# Altium schematic sheet Auxboardone.SchDoc
size Tabloid; SheetNumber: 1; SheetTotal: 1
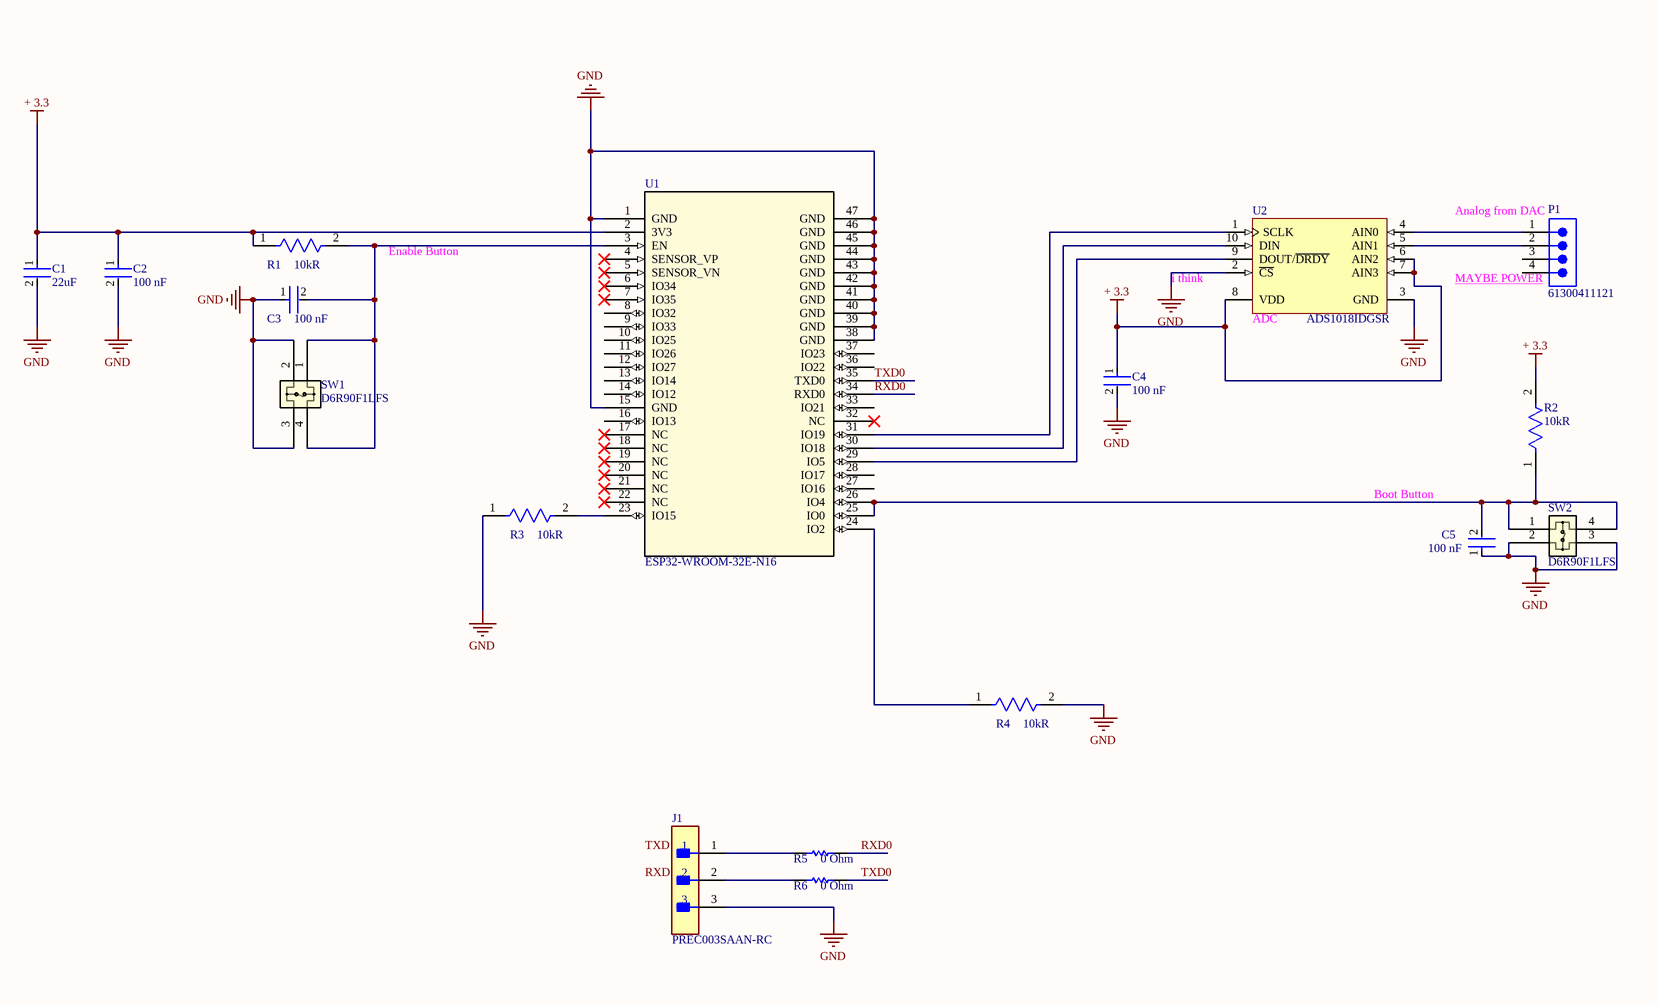
[diagram p0: Auxboardone.SchDoc, right]

## Parts
C1  Capacitance: 22uF  [FP-CL21-IPC_A]  (hidden comment: CL21A226MQQNNNE)
C2  Capacitance: 100 nF  [FP-CC0805-0_85-MFG]  (hidden comment: CC0805KRX7R9BB104)
C3  Capacitance: 100 nF  [FP-CC0805-0_85-MFG]  (hidden comment: CC0805KRX7R9BB104)
C4  Capacitance: 100 nF  [FP-CC0805-0_85-MFG]  (hidden comment: CC0805KRX7R9BB104)
C5  Capacitance: 100 nF  [FP-CC0805-0_85-MFG]  (hidden comment: CC0805KRX7R9BB104)
J1  PREC003SAAN-RC  [FP-PREC003SAAN-RC-MFG]
P1  61300411121  [61300411121]
R1  Resistance: 10kR  [FP-RR1220-IPC_A]  (hidden comment: RR1220P-103-D)
R2  Resistance: 10kR  [FP-RR1220-IPC_A]  (hidden comment: RR1220P-103-D)
R3  Resistance: 10kR  [FP-RR1220-IPC_A]  (hidden comment: RR1220P-103-D)
R4  Resistance: 10kR  [FP-RR1220-IPC_A]  (hidden comment: RR1220P-103-D)
R5  Resistance: 0 Ohm  [RESC2013X70X40NL20T20]  (hidden comment: ERJ-6GEY0R00V)
R6  Resistance: 0 Ohm  [RESC2013X70X40NL20T20]  (hidden comment: ERJ-6GEY0R00V)
SW1  D6R90F1LFS  [D6R_CNK]
SW2  D6R90F1LFS  [D6R_CNK]
U1  ESP32-WROOM-32E-N16  [ESP32-WROOM-32E_EXP]
U2  ADS1018IDGSR  [TI-DGS10_N]

## Nets
+ 3.3: C1.1 C2.1 C4.1 R1.1 R2.2 U1.2(3V3) U2.6(AIN2) U2.7(AIN3) U2.8(VDD)
GND: C1.2 C2.2 C3.1 C4.2 C5.1 J1.3 R3.1 R4.2 SW1.2 SW1.3 SW2.2 SW2.3 U1.1(GND) U1.15(GND) U1.38(GND) U1.39(GND) U1.40(GND) U1.41(GND) U1.42(GND) U1.43(GND) U1.44(GND) U1.45(GND) U1.46(GND) U1.47(GND) U2.2(~{CS}) U2.3(GND)
RXD0: R5.2 U1.34(RXD0)
TXD0: R6.2 U1.35(TXD0)
NetC3_2: C3.2 R1.2 SW1.1 SW1.4 U1.3(EN)
NetC5_2: C5.2 R2.1 SW2.1 SW2.4 U1.25(IO0) U1.26(IO4)
NetJ1_1: J1.1 R5.1
NetJ1_2: J1.2 R6.1
NetP1_1: P1.1 U2.4(AIN0)
NetP1_2: P1.2 U2.5(AIN1)
NetR3_2: R3.2 U1.23(IO15)
NetR4_1: R4.1 U1.24(IO2)
NetU1_29: U1.29(IO5) U2.9(DOUT/~{DRDY})
NetU1_30: U1.30(IO18) U2.10(DIN)
NetU1_31: U1.31(IO19) U2.1(SCLK)

Not connected (* = marked no-connect by the designer): P1 3 4; U1 4(SENSOR_VP)* 5(SENSOR_VN)* 6(IO34)* 7(IO35)* 8(IO32) 9(IO33) 10(IO25) 11(IO26) 12(IO27) 13(IO14) 14(IO12) 16(IO13) 17(NC)* 18(NC)* 19(NC)* 20(NC)* 21(NC)* 22(NC)* 27(IO16) 28(IO17) 32(NC)* 33(IO21) 36(IO22) 37(IO23)

## Notes on the sheet
- Enable Button
- (near P1) Analog from DAC
- (near U2) i think
- (near U2) ADC
- (near P1) MAYBE POWER
- Boot Button
- Labels drawn without touching a wire or pin: RXD, TXD

## Library data of the parts
C1 = CMP-13271-000185-1: CL21 Series 0805 22uF 6.3V ±20% Tolerance X5R Multilayer Ceramic Chip Capacitor; Height: 1.25mm; Length: 2mm; Mount: Surface Mount; Dielectric: X5R; Voltage Rating (DC): 6.3V; Case Code (Metric): 2012; Depth: 1.25mm; Max Operating Temperature: 85°C; Voltage Rating: 6.3V; Width: 0.049inch; Case/Package: 0805; Radiation Hardening: No; Thickness: 0.055inch; Packaging: Tape and Reel; Package Quantity: 2000; Lead Free: Lead Free; Contact Plating: Tin; Min Operating Temperature: -55°C; Case Code (Imperial): 0805; Tolerance: 20%
C2-C5 = CMP-2100-03606-3: CAP CER 0.1UF 50V X7R 0805; Manufacturer: Yageo; Tolerance: 0.1; Value: 100 nF; Material: Ceramic; Device Class L1: Passive Components; ComponentLink2Description: Datasheet; Package: CC0805-0.85; Manufacturer Part Number: CC0805KRX7R9BB104; Digikey Description: CAP CER 0.1UF 50V X7R 0805; Device Class L3: Ceramic Capacitors; Temperature: -30°C to +85°C; Temperature Characteristic: X7R; Voltage Rating: 50 V; Height: 0.95mm; RoHS: TRUE; Ipc Land Pattern Name: CAPC200125X85; Device Class L2: Capacitors; Category: Cap; Temperature Range Low: -30°C; Temperature Range High: +85°C; Mouser Description: Multilayer Ceramic Capacitors MLCC - SMD/SMT 100nF 50V X7R 10%; Footprint Url: http://www.yageo.com/exep/pages/download/literatures/UPY-C_GEN_24.pdf; Automotive: No; Octopart: https://octopart.com/cc0805krx7r9bb104-yageo-192993; Lead Free: Yes; ComponentLink2URL: http://www.yageo.com/documents/recent/UPY-GPHC_Y5V_6.3V-to-50V_8.pdf
J1 = CMP-00595-22265080-1: PREC003SAAN-RC Conn Header Vert 3POS 2.54MM; Number of Contacts: 3; Connector Type: Male Pin; Current Rating: 3A; Height: 8.74mm; Contact Mating Length: 5.842mm; Min Operating Temperature: -40°C; Termination: Solder; Packaging: Bulk; Pitch: 2.54mm; Color: Black; Mount: Through Hole; Contact Material: Nickel, Tin; Number of Rows: 1; NexarPartId: 22265080; Max Operating Temperature: 105°C; RoHS: Compliant; Contact Plating: Tin; Number of Positions: 3
P1 = CMP-1502-01064-3: NexarPartId: 32855522; Operating Supply Voltage: 250V; Pitch: 2.54mm; Contact Resistance: 20mΩ; Number of Positions: 4; Current Rating: 3A; Connector Type: Male Pin; Gender: Male; Contact Plating: Gold; Height: 8.89mm; Lead Pitch: 2.54mm; Lead Free: Lead Free; Contact Mating Length: 5.9944mm; Number of Rows: 1; Termination: Solder; Packaging: Bulk; REACH SVHC: Unknown; Min Operating Temperature: -40°C; RoHS: Compliant; Number of Contacts: 4; Voltage Rating: 250V; Color: Black; Max Operating Temperature: 105°C; Contact Material: Copper; Mount: Through Hole; Orientation: Vertical; Number of Pins: 4
R1-R4 = CMP-2001-03215-2: 10kΩ ±0.5% 0.1W 1/10W Chip Resistor 0805 (2012 Metric) Thin Film; Max Power Dissipation: 100mW; Voltage Rating: 100V; Temperature Coefficient: 25ppm/°C; Size Code: 0805; RoHS Compliant: Yes; Package Quantity: 1; Resistance Tolerance: 0.5%; Depth: 1.25mm; Lead Free: Lead Free; Series: RR; Min Operating Temperature: -55°C; Weight: 0.000194oz; Width: 1.25mm; Packaging: Tape and Reel; Termination: SMD/SMT; Length: 2mm; Power Rating: 100mW; Case Code (Metric): 2012; Resistor Type: Thin Film; Height: 0.4mm; Case/Package: 0805; Case Code (Imperial): 0805; Technology: THIN FILM; Max Operating Temperature: 125°C; Voltage Rating (DC): 100V; Number of Terminations: 2; Tolerance: 0.5%
R5 R6 = CMP-1665-00002-5: Chip Resistor, 0 Ohm, +/- 1%, 0.125 W, -55 to 155 degC, 0805 (2012 Metric), RoHS, Tape and Reel; Tolerance: 5%; REACH SVHC: No SVHC; Min Operating Temperature: -55 degC; Case/Package: 0805; Packaging: Tape and Reel; Package Quantity: 5000; ComponentLink1Description: Manufacturer URL; PackageDescription: 2-Pin Surface Mount Device, Body 2 x 1.25 mm; Mounting Technology: Surface Mount; Max Operating Temperature: 155 degC; PartNumber: ERJ-6GEY0R00V; Width: 1.25 mm; RoHSCompliant: True; Height: 0.6 mm; ComponentLink1URL: http://www.panasonic.com/; ComponentLink2URL: http://industrial.panasonic.com/cdbs/www-data/pdf/RDA0000/AOA0000C84.pdf; Case Code (Imperial): 0805; DatasheetVersion: 03/2015; Length: 2 mm; Case Code (Metric): 2012; ComponentLink2Description: Datasheet; Radiation Hardening: No
SW1 SW2 = D6R90F1LFS: No Description Available; Mfr_Name: C&K Components; RefDes: RefDes; Type: Type
U1 = ESP32-WROOM-32E-N16: No Description Available; Mfr_Name: Espressif Systems; Type: RF; RefDes: RefDes
U2 = CMP-0003-00373-2: 12-Bit ADC with Integrated MUX, PGA, Temperature Sensor, Oscillator and Reference, -40 to 125 degC, 10-pin SOP (DGS10), Green (RoHS & no Sb/Br); Manufacturer: Texas Instruments; Resolution(Bits): 12; Digital Supply(Min)(V): 2; Analog Voltage AV/DD(Max)(V): 5.5; # Input Channels: 4; Architecture: Delta-Sigma; Interface: Serial SPI; INL(Max)(+/-LSB): 0.5; Sample Rate(max)(SPS): 3.3k; SubFamily: Precision ADC (<=10MSPS); PackageDescription: 10-Pin Plastic Small Outline, Body 3 x 3 mm, Pitch 0.5 mm; PackageVersion: 4073272/C, 02/2004; Mounting Technology: Surface Mount; DatasheetVersion: SBAS526A; ComponentLink3URL: http://www.ti.com/lit/ml/mpds035b/mpds035b.pdf; ComponentLink2URL: http://www.ti.com/lit/ds/symlink/ads1018.pdf; ComponentLink2Description: Datasheet; ComponentLink3Description: Package Specification; PartNumber: ADS1018IDGSR; ComponentLink1URL: http://www.ti.com/; ComponentLink1Description: Manufacturer URL; Code_JEDEC: MO-153; Eco-Plan: Green (RoHS & no Sb/Br); PackageReference: DGS10; Digital Supply(Max)(V): 5.5; Analog Voltage AV/DD(Min)(V): 2